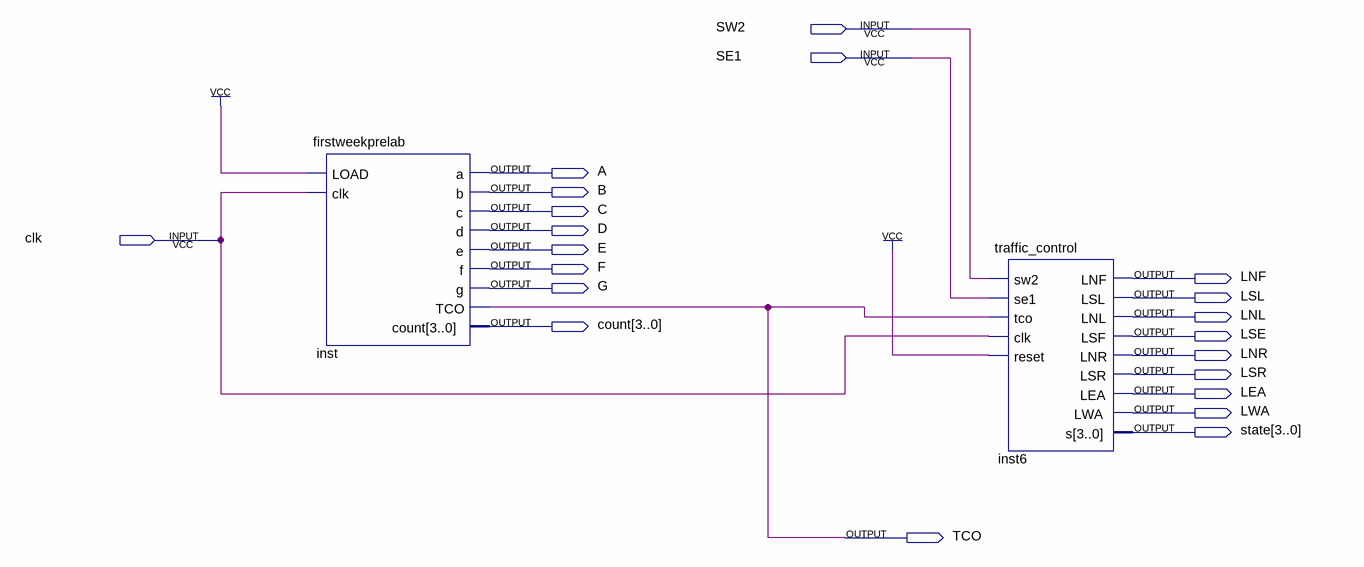
[diagram p0: schematic sheet]
// Quartus schematic exp3.bdf as structural Verilog: 2 symbols, 21 pins
module exp3 (
  input  SW2,
  input  SE1,
  input  clk,
  output A,
  output B,
  output C,
  output D,
  output E,
  output F,
  output LNF,
  output G,
  output LSL,
  output LNL,
  output [3:0] count,
  output LSE,
  output LNR,
  output LSR,
  output LEA,
  output LWA,
  output [3:0] state,
  output TCO
);

  firstweekprelab inst (
    .LOAD(1'b1), .clk(clk), .a(A), .b(B), .c(C), .d(D), .e(E), .f(F), .g(G), .TCO(TCO), .count(count));
  traffic_control inst6 (
    .sw2(SW2), .se1(SE1), .tco(TCO), .clk(clk), .reset(1'b1), .LNF(LNF), .LSL(LSL), .LNL(LNL), .LSF(LSE),
    .LNR(LNR), .LSR(LSR), .LEA(LEA), .LWA(LWA), .s(state));
endmodule
